# Altium schematic sheet MCU.SchDoc
size A4; SheetNumber: 2; SheetTotal: 18
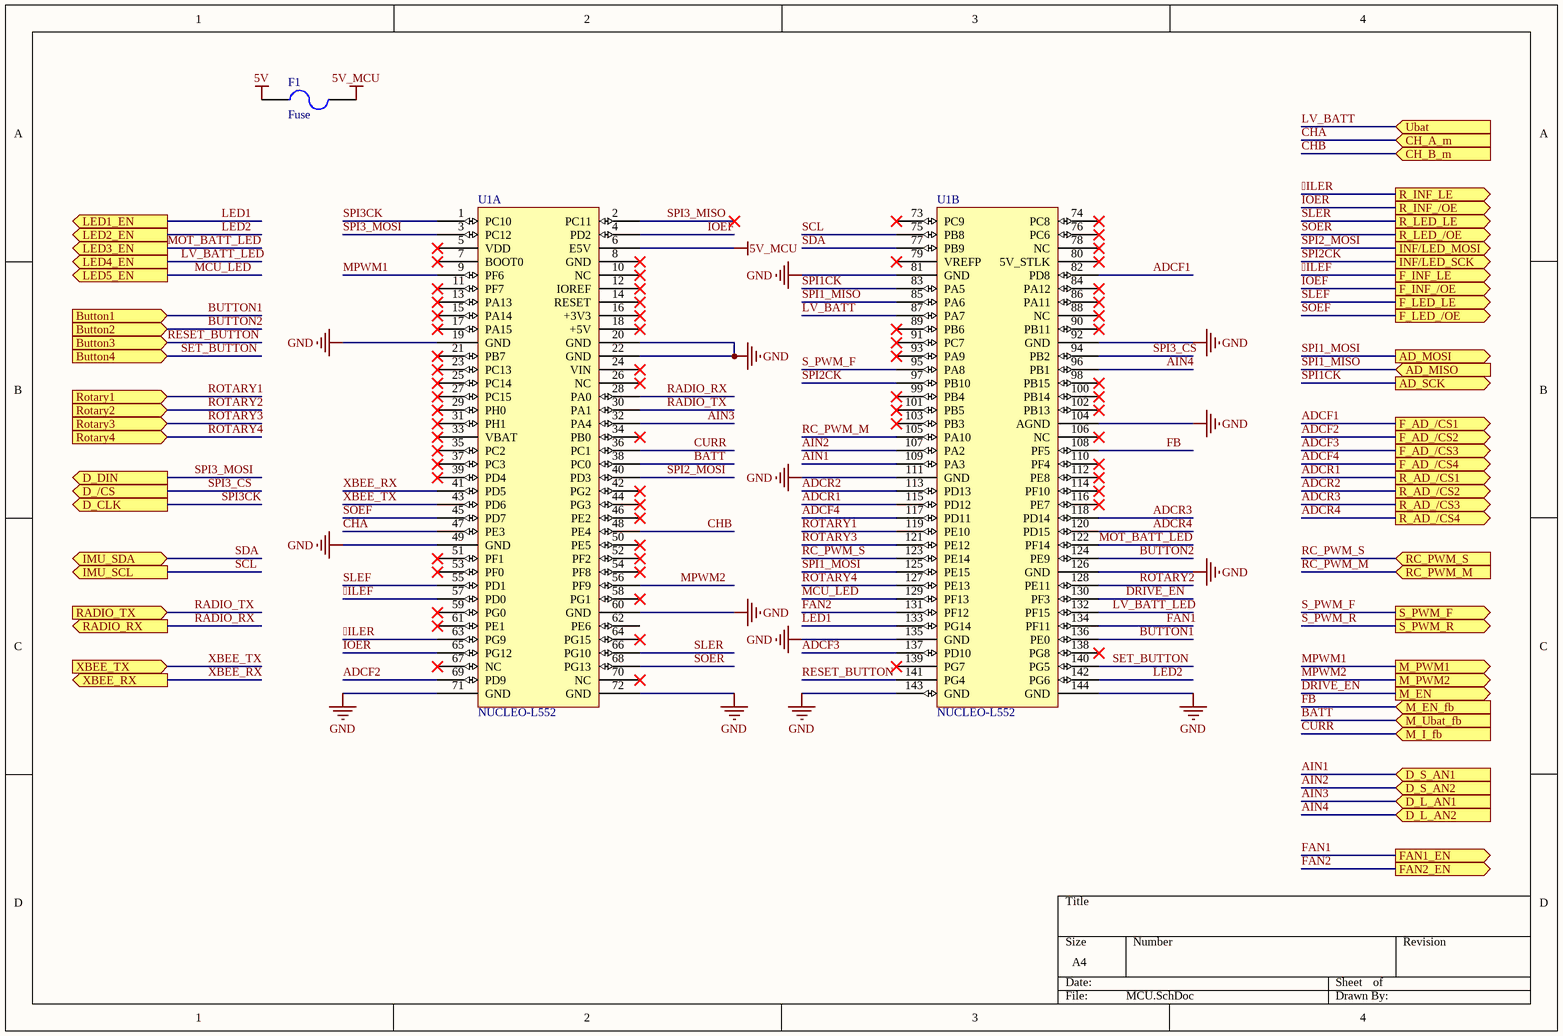
[diagram p0: MCU.SchDoc]

## Parts
F1  Fuse  [F_0603]
U1  NUCLEO-L552  [FP_NUCLEO-144]  (parts A,B of 2)

## Ports
AD_MISO (in), AD_MOSI (out), AD_SCK (out), Button1 (in), Button2 (in), Button3 (in), Button4 (in), CH_A_m (in), CH_B_m (in), D_/CS (out), D_CLK (out), D_DIN (out), D_L_AN1 (in), D_L_AN2 (in), D_S_AN1 (in), D_S_AN2 (in), F_AD_/CS1 (out), F_AD_/CS2 (out), F_AD_/CS3 (out), F_AD_/CS4 (out), F_INF_/OE (out), F_INF_LE (out), F_LED_/OE (out), F_LED_LE (out), FAN1_EN (out), FAN2_EN (out), IMU_SCL (out), IMU_SDA (bidir), INF/LED_MOSI (out), INF/LED_SCK (out), LED1_EN (out), LED2_EN (out), LED3_EN (out), LED4_EN (out), LED5_EN (out), M_EN (out), M_EN_fb (in), M_I_fb (in), M_PWM1 (out), M_PWM2 (out), M_Ubat_fb (in), R_AD_/CS1 (out), R_AD_/CS2 (out), R_AD_/CS3 (out), R_AD_/CS4 (out), R_INF_/OE (out), R_INF_LE (out), R_LED_/OE (out), R_LED_LE (out), RADIO_RX (out), RADIO_TX (in), RC_PWM_M (in), RC_PWM_S (in), Rotary1 (in), Rotary2 (in), Rotary3 (in), Rotary4 (in), S_PWM_F (out), S_PWM_R (out), Ubat (in), XBEE_RX (out), XBEE_TX (in)

## Nets
5V: F1.1
5V_MCU: F1.2 U1.6(E5V)
GND: U1.19(GND) U1.20(GND) U1.22(GND) U1.49(GND) U1.60(GND) U1.71(GND) U1.72(GND) U1.81(GND) U1.92(GND) U1.104(AGND) U1.111(GND) U1.126(GND) U1.135(GND) U1.143(GND) U1.144(GND)
ILEF: U1.57(PD0) ; port F_INF_LE
ILER: U1.63(PG9) ; port R_INF_LE
ADCF1: U1.82(PD8) ; port F_AD_/CS1
ADCF2: U1.69(PD9) ; port F_AD_/CS2
ADCF3: U1.137(PD10) ; port F_AD_/CS3
ADCF4: U1.117(PD11) ; port F_AD_/CS4
ADCR1: U1.115(PD12) ; port R_AD_/CS1
ADCR2: U1.113(PD13) ; port R_AD_/CS2
ADCR3: U1.118(PD14) ; port R_AD_/CS3
ADCR4: U1.120(PD15) ; port R_AD_/CS4
AIN1: U1.109(PA3) ; port D_S_AN1
AIN2: U1.107(PA2) ; port D_S_AN2
AIN3: U1.32(PA4) ; port D_L_AN1
AIN4: U1.96(PB1) ; port D_L_AN2
BATT: U1.38(PC0) ; port M_Ubat_fb
BUTTON1: U1.136(PE0) ; port Button1
BUTTON2: U1.124(PE9) ; port Button2
CHA: U1.47(PE3) ; port CH_A_m
CHB: U1.48(PE4) ; port CH_B_m
CURR: U1.36(PC1) ; port M_I_fb
DRIVE_EN: U1.130(PF3) ; port M_EN
FAN1: U1.134(PF11) ; port FAN1_EN
FAN2: U1.131(PF12) ; port FAN2_EN
FB: U1.108(PF5) ; port M_EN_fb
IOEF: U1.4(PD2) ; port F_INF_/OE
IOER: U1.65(PG12) ; port R_INF_/OE
LED1: U1.133(PG14) ; port LED1_EN
LED2: U1.142(PG6) ; port LED2_EN
LV_BATT: U1.87(PA7) ; port Ubat
LV_BATT_LED: U1.132(PF15) ; port LED4_EN
MCU_LED: U1.129(PF13) ; port LED5_EN
MOT_BATT_LED: U1.122(PF14) ; port LED3_EN
MPWM1: U1.9(PF6) ; port M_PWM1
MPWM2: U1.56(PF9) ; port M_PWM2
RADIO_RX: U1.28(PA0) ; port RADIO_RX
RADIO_TX: U1.30(PA1) ; port RADIO_TX
RC_PWM_M: U1.105(PA10) ; port RC_PWM_M
RC_PWM_S: U1.123(PE14) ; port RC_PWM_S
RESET_BUTTON: U1.141(PG4) ; port Button3
ROTARY1: U1.119(PE10) ; port Rotary1
ROTARY2: U1.128(PE11) ; port Rotary2
ROTARY3: U1.121(PE12) ; port Rotary3
ROTARY4: U1.127(PE13) ; port Rotary4
S_PWM_F: U1.95(PA8) ; port S_PWM_F
S_PWM_R: port S_PWM_R
SCL: U1.75(PB8) ; port IMU_SCL
SDA: U1.77(PB9) ; port IMU_SDA
SET_BUTTON: U1.140(PG5) ; port Button4
SLEF: U1.55(PD1) ; port F_LED_LE
SLER: U1.66(PG10) ; port R_LED_LE
SOEF: U1.45(PD7) ; port F_LED_/OE
SOER: U1.68(PG13) ; port R_LED_/OE
SPI1_MISO: U1.85(PA6) ; port AD_MISO
SPI1_MOSI: U1.125(PE15) ; port AD_MOSI
SPI1CK: U1.83(PA5) ; port AD_SCK
SPI2_MOSI: U1.40(PD3) ; port INF/LED_MOSI
SPI2CK: U1.97(PB10) ; port INF/LED_SCK
SPI3_CS: U1.94(PB2) ; port D_/CS
SPI3_MISO: U1.2(PC11)
SPI3_MOSI: U1.3(PC12) ; port D_DIN
SPI3CK: U1.1(PC10) ; port D_CLK
XBEE_RX: U1.41(PD5) ; port XBEE_RX
XBEE_TX: U1.43(PD6) ; port XBEE_TX

Not connected (* = marked no-connect by the designer): U1 5(VDD)* 7(BOOT0)* 8(GND)* 10(NC)* 11(PF7)* 12(IOREF)* 13(PA13)* 14(RESET)* 15(PA14)* 16(+3V3)* 17(PA15)* 18(+5V)* 21(PB7)* 23(PC13)* 24(VIN)* 25(PC14)* 26(NC)* 27(PC15)* 29(PH0)* 31(PH1)* 33(VBAT)* 34(PB0)* 35(PC2)* 37(PC3)* 39(PD4)* 42(PG2)* 44(PG3)* 46(PE2)* 50(PE5)* 51(PF1)* 52(PF2)* 53(PF0)* 54(PF8)* 58(PG1)* 59(PG0)* 61(PE1)* 62(PE6) 64(PG15)* 67(NC)* 70(NC)* 73(PC9)* 74(PC8)* 76(PC6)* 78(NC)* 79(VREFP)* 80(5V_STLK)* 84(PA12)* 86(PA11)* 88(NC)* 89(PB6)* 90(PB11)* 91(PC7)* 93(PA9)* 98(PB15)* 99(PB4)* 100(PB14)* 101(PB5)* 102(PB13)* 103(PB3)* 106(NC)* 110(PF4)* 112(PE8)* 114(PF10)* 116(PE7)* 138(PG8)* 139(PG7)*

## Library data of the parts
F1 = Oth_MC06CF.500_F_0603: NI part number: 766324-01; Order number: 1841006; Rating: 32VDC; Type: Very Fast Acting Fuse; Value: 500mA; NI PEN/DEB: DEB; Distributor: Farnell; ID: Oth_MC06CF.500_F_0603; Link: http://hu.farnell.com/multicomp/mc06cf-500/fuse-smd-0603-0-5a/dp/1841006; Package: F_0603; Part Number: MC06CF.500; Price (HUF): 125
U1 = NUCLEO-L552: https://www.st.com/resource/en/user_manual/um2581-stm32l5-nucleo144-board-mb1361-stmicroelectronics.pdf; Reference: NUCLEO; Name: Nucleo L552; Supplier: Tanszék